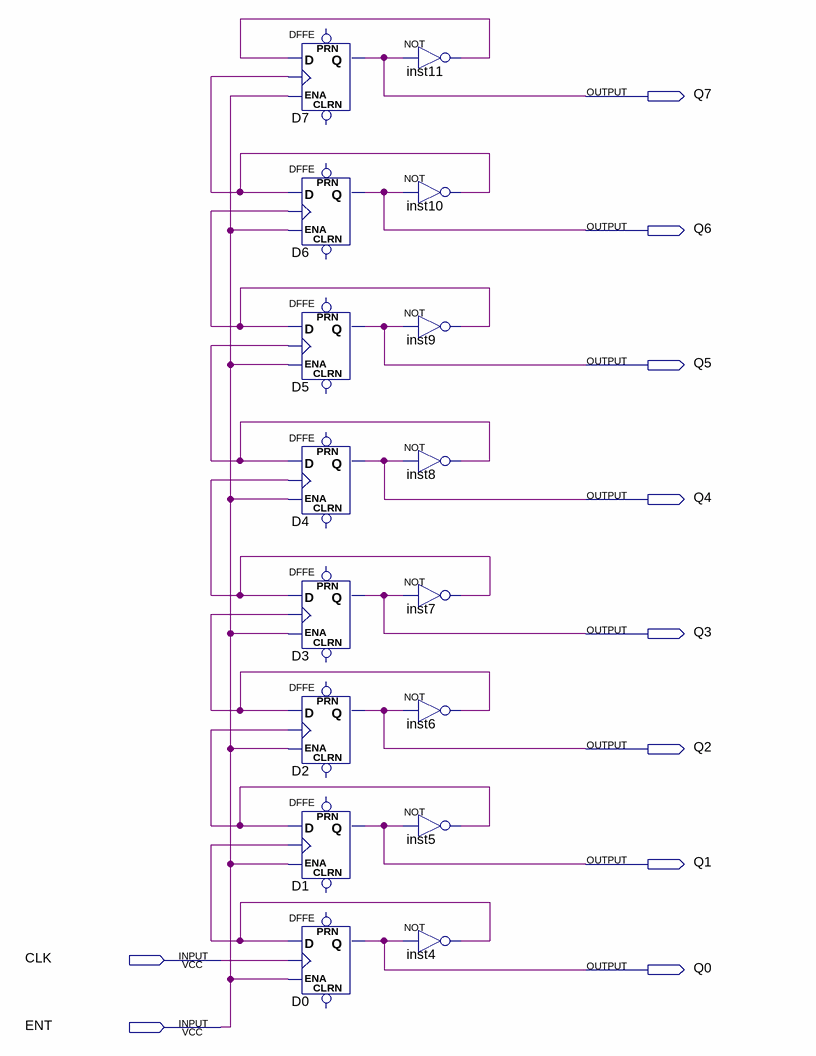
[diagram p0: schematic sheet]
// Quartus schematic PC.bdf as structural Verilog: 16 symbols, 10 pins
module PC (
  input  CLK,
  input  ENT,
  output Q7,
  output Q6,
  output Q5,
  output Q4,
  output Q3,
  output Q2,
  output Q1,
  output Q0
);

  wire inst4_out, inst5_out, inst6_out, inst7_out, inst8_out, inst9_out, inst10_out, inst11_out;

  DFFE D7 (.D(inst11_out), .CLK(inst10_out), .ENA(ENT), .Q(Q7));  // open: PRN, CLRN
  DFFE D6 (.D(inst10_out), .CLK(inst9_out), .ENA(ENT), .Q(Q6));  // open: PRN, CLRN
  DFFE D5 (.D(inst9_out), .CLK(inst8_out), .ENA(ENT), .Q(Q5));  // open: PRN, CLRN
  DFFE D4 (.D(inst8_out), .CLK(inst7_out), .ENA(ENT), .Q(Q4));  // open: PRN, CLRN
  DFFE D3 (.D(inst7_out), .CLK(inst6_out), .ENA(ENT), .Q(Q3));  // open: PRN, CLRN
  DFFE D2 (.D(inst6_out), .CLK(inst5_out), .ENA(ENT), .Q(Q2));  // open: PRN, CLRN
  DFFE D1 (.D(inst5_out), .CLK(inst4_out), .ENA(ENT), .Q(Q1));  // open: PRN, CLRN
  DFFE D0 (.D(inst4_out), .CLK(CLK), .ENA(ENT), .Q(Q0));  // open: PRN, CLRN
  not inst11 (inst11_out, Q7);
  not inst10 (inst10_out, Q6);
  not inst9 (inst9_out, Q5);
  not inst8 (inst8_out, Q4);
  not inst7 (inst7_out, Q3);
  not inst6 (inst6_out, Q2);
  not inst5 (inst5_out, Q1);
  not inst4 (inst4_out, Q0);
endmodule
